# Altium schematic sheet Analog_Channel_Test.SchDoc
size A4; SheetNumber: 1; SheetTotal: 7
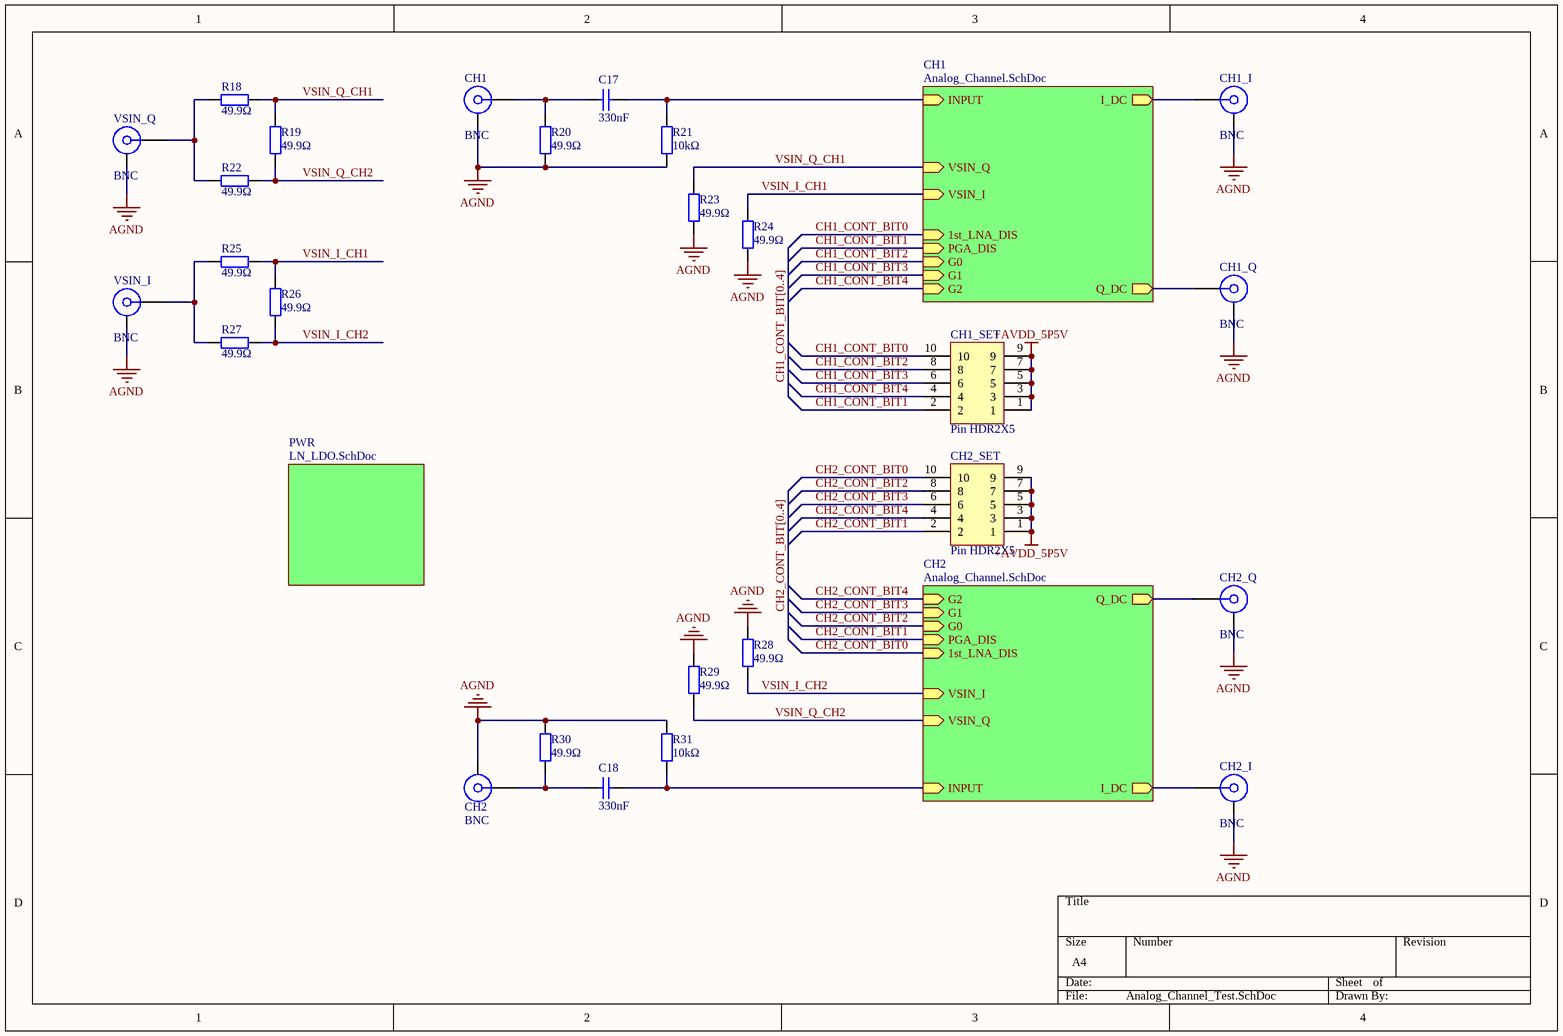
[diagram p0: Analog_Channel_Test.SchDoc]

## Parts
C17  330nF  [1206_C]
C18  330nF  [1206_C]
CH1  BNC  [BNC-TYCO_1-1337542-0]
CH1_I  BNC  [BNC-TYCO_1-1337542-0]
CH1_Q  BNC  [BNC-TYCO_1-1337542-0]
CH1_SET  Pin HDR2X5  [Pin HDR2X5/2.54mm-S]
CH2  BNC  [BNC-TYCO_1-1337542-0]
CH2_I  BNC  [BNC-TYCO_1-1337542-0]
CH2_Q  BNC  [BNC-TYCO_1-1337542-0]
CH2_SET  Pin HDR2X5  [Pin HDR2X5/2.54mm-S]
R18  49.9Ω  [0603_R]
R19  49.9Ω  [0603_R]
R20  49.9Ω  [0603_R]
R21  10kΩ  [0603_R]
R22  49.9Ω  [0603_R]
R23  49.9Ω  [0603_R]
R24  49.9Ω  [0603_R]
R25  49.9Ω  [0603_R]
R26  49.9Ω  [0603_R]
R27  49.9Ω  [0603_R]
R28  49.9Ω  [0603_R]
R29  49.9Ω  [0603_R]
R30  49.9Ω  [0603_R]
R31  10kΩ  [0603_R]
VSIN_I  BNC  [BNC-TYCO_1-1337542-0]
VSIN_Q  BNC  [BNC-TYCO_1-1337542-0]

## Sub-sheets
CH1 = Analog_Channel.SchDoc: VSIN_I (in), INPUT (in), I_DC (out), Q_DC (out), 1st_LNA_DIS (in), PGA_DIS (in), G0 (in), G1 (in), G2 (in), VSIN_Q (in)
CH2 = Analog_Channel.SchDoc: VSIN_I (in), INPUT (in), I_DC (out), Q_DC (out), 1st_LNA_DIS (in), PGA_DIS (in), G0 (in), G1 (in), G2 (in), VSIN_Q (in)
PWR = LN_LDO.SchDoc: no entries

## Nets
+AVDD_5P5V: CH1_SET.1 CH1_SET.3 CH1_SET.5 CH1_SET.7 CH1_SET.9 CH2_SET.1 CH2_SET.3 CH2_SET.5 CH2_SET.7 CH2_SET.9
AGND: CH1.MH CH1_I.MH CH1_Q.MH CH2.MH CH2_I.MH CH2_Q.MH R20.1 R21.1 R23.1 R24.1 R28.1 R29.1 R30.1 R31.1 VSIN_I.MH VSIN_Q.MH
CH1_CONT_BIT0: CH1_SET.10 ; sheet CH1/1st_LNA_DIS
CH1_CONT_BIT1: CH1_SET.2 ; sheet CH1/PGA_DIS
CH1_CONT_BIT2: CH1_SET.8 ; sheet CH1/G0
CH1_CONT_BIT3: CH1_SET.6 ; sheet CH1/G1
CH1_CONT_BIT4: CH1_SET.4 ; sheet CH1/G2
CH2_CONT_BIT0: CH2_SET.10 ; sheet CH2/1st_LNA_DIS
CH2_CONT_BIT1: CH2_SET.2 ; sheet CH2/PGA_DIS
CH2_CONT_BIT2: CH2_SET.8 ; sheet CH2/G0
CH2_CONT_BIT3: CH2_SET.6 ; sheet CH2/G1
CH2_CONT_BIT4: CH2_SET.4 ; sheet CH2/G2
VSIN_I_CH1: R24.2 R25.1 R26.1 ; sheet CH1/VSIN_I
VSIN_I_CH2: R26.2 R27.1 R28.2 ; sheet CH2/VSIN_I
VSIN_Q_CH1: R18.1 R19.1 R23.2 ; sheet CH1/VSIN_Q
VSIN_Q_CH2: R19.2 R22.1 R29.2 ; sheet CH2/VSIN_Q
NetC17_1: C17.1 CH1.1 R20.2
NetC17_2: C17.2 R21.2 ; sheet CH1/INPUT
NetC18_1: C18.1 CH2.1 R30.2
NetC18_2: C18.2 R31.2 ; sheet CH2/INPUT
NetCH1_I_1: CH1_I.1 ; sheet CH1/I_DC
NetCH1_Q_1: CH1_Q.1 ; sheet CH1/Q_DC
NetCH2_I_1: CH2_I.1 ; sheet CH2/I_DC
NetCH2_Q_1: CH2_Q.1 ; sheet CH2/Q_DC
NetR18_2: R18.2 R22.2 VSIN_Q.1
NetR25_2: R25.2 R27.2 VSIN_I.1

## Buses and harness runs
bus CH1_CONT_BIT[0..4]
bus CH2_CONT_BIT[0..4]

## Library data of the parts
C17 C18 = 1206 100nF (104) 10% 50V: 贴片电容; ComponentLink1Description: 供应商链接; ComponentLink1URL: http://www.szlcsc.com/product/details_25237.html; Package: 1206; Supplier: LC; SuppliersPartNumber: C24497
CH1 CH1_I CH1_Q CH2 CH2_I CH2_Q VSIN_I VSIN_Q = BNC: BNC-KE PIN 6.9mm distance; PartNumber: 51K101-400A4; Design Note: Footprint in library is a generic example - only application specific footprint delivers High Performance; DatasheetVersion: c00; PackageVersion: c00; PackageReference: 51K101-400A4; PackageDescription: 50R BNC Straight Jack, 12 x 12 x 15 mm; Mounting Technology: Through Hole; ComponentLink1Description: Manufacturer URL; ComponentLink1URL: http://www.rosenberger.de; ComponentLink2Description: Datasheet; ComponentLink2URL: http://rosenberger.de/ok/images/documents/db/51K101-400A4.pdf; ComponentLink3Description: Package Specification; ComponentLink3URL: http://rosenberger.de/ok/images/documents/db/51K101-400A4.pdf; ComponentLink4Description: URL Link1; ComponentLink4URL: Series Overview / Design Note:http://rosenberger.de/ok/images/documents/spez/51.pdf; ComponentLink5Description: Webshop / RFQ; ComponentLink5URL: http://www.rosenberger.com/en/contact/sales/
R18-R20 R22-R30 = 0603 49.9Ω (49R9) 1%: 贴片电阻; ComponentLink1Description: 供应商链接; ComponentLink1URL: http://www.szlcsc.com/product/details_23912.html; Package: 0603; Supplier: LC; SuppliersPartNumber: C23185
R21 R31 = 0603 10KΩ (1002) 1%: 贴片电阻; ComponentLink1Description: 供应商链接; ComponentLink1URL: http://www.szlcsc.com/product/details_26547.html; Package: 0603; Supplier: LC; SuppliersPartNumber: C25804